# Altium schematic sheet [08]Debug Headers and Support.SchDoc
size A4; Organization: Altium Limited; Address1: L3, 12a Rodborough Rd; Address2: Frenchs Forest; Address3: NSW; Address4: Australia 2086
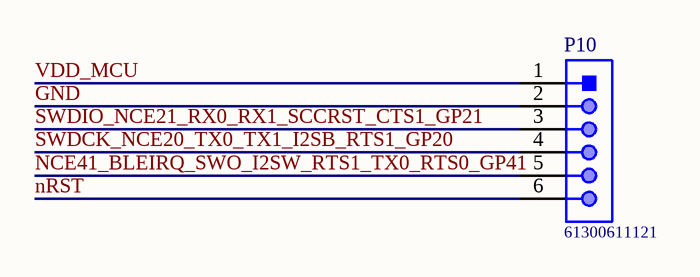
[diagram p0: [08]Debug Headers and Support.SchDoc]

## Parts
P10  61300611121  [61300611121]

## Nets
GND: P10.2
NCE41_BLEIRQ_SWO_I2SW_RTS1_TX0_RTS0_GP41: P10.5
nRST: P10.6
SWDCK_NCE20_TX0_TX1_I2SB_RTS1_GP20: P10.4
SWDIO_NCE21_RX0_RX1_SCCRST_CTS1_GP21: P10.3
VDD_MCU: P10.1

## Notes on the sheet
- Title
- Size:
- Date:
- A3
- Number:
- Time:
- Revision:
- Sheet
- of
- File:

## Library data of the parts
P10 = CMP-1502-01070-1: THT Vertical Pin Header WR-PHD, Pitch 2.54 mm, Single Row, 6 pins; Manufacturer: Wurth Elektronik; Gender: Male; Pin Number: 6; Pitch: 2.54mm; Working Voltage: 250VAC; Rated Current: 3A; Withstanding Voltage: 500VAC; Contact Resistance: 20mOhm; Operating Temperature: -40to105degC; Packaging: Bag; Datasheet URL: https://katalog.we-online.de/em/datasheet/6130xx11121.pdf; Package Reference: 61300611121; Mounting Technology: THT; Publisher: WurthElektronik; Part Number: 61300611121; Manufacturer URL: http://www.we-online.de; Row Number: Single; Orientation: Vertical